# EAGLE design MSEE LCD Breakout Board (EAGLE 9.5.2)
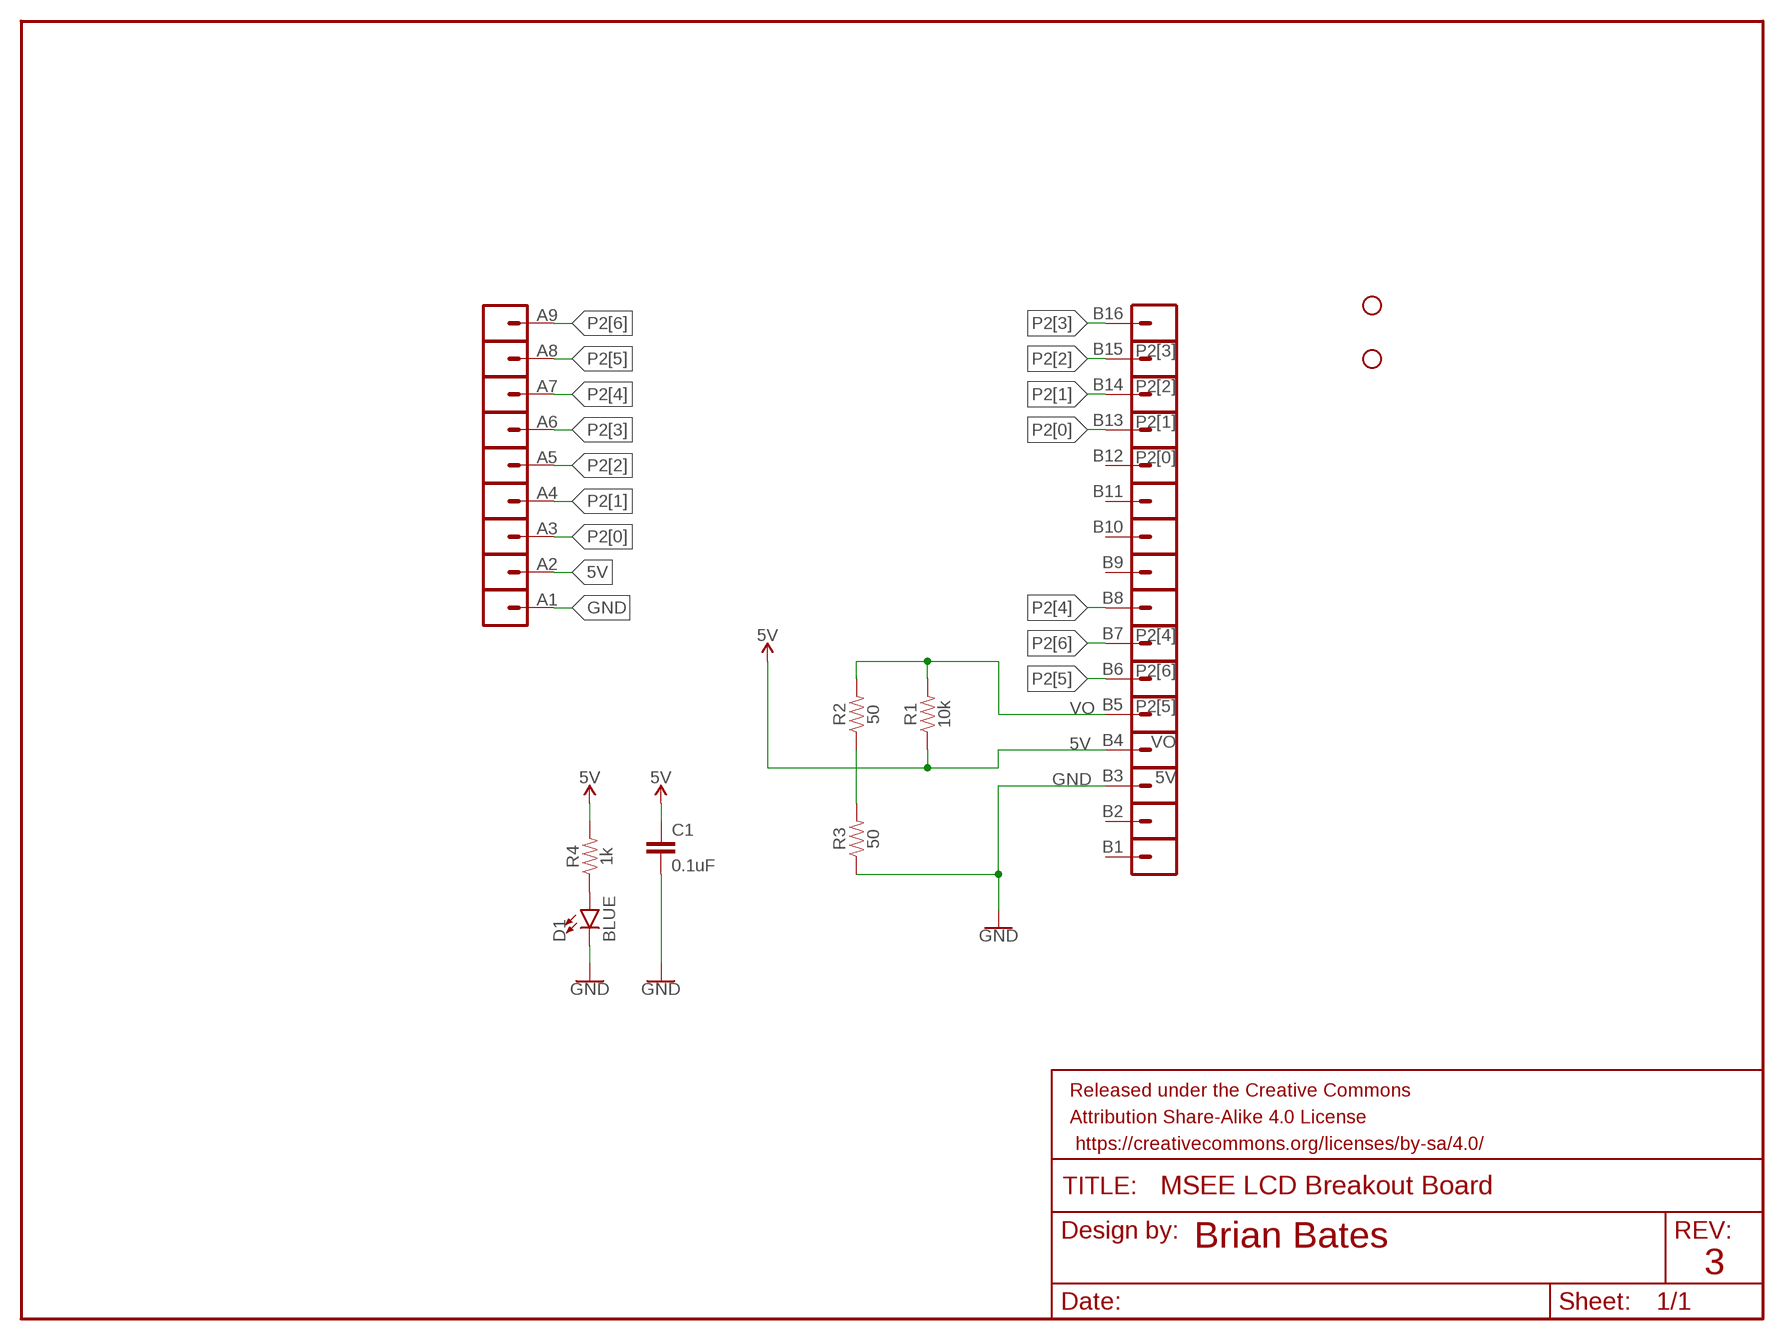
[diagram p0: schematic, sheet 1]

## Parts
5V  A2  CONN_01PTH_LONGPAD  [1X01_LONGPAD]
B1  CONN_01PTH_LONGPAD  [1X01_LONGPAD]
B2  CONN_01PTH_LONGPAD  [1X01_LONGPAD]
B3  GND  CONN_01PTH_LONGPAD  [1X01_LONGPAD]
B4  5V  CONN_01PTH_LONGPAD  [1X01_LONGPAD]
B5  VO  CONN_01PTH_LONGPAD  [1X01_LONGPAD]
B6  P2[5]  CONN_01PTH_LONGPAD  [1X01_LONGPAD]
B7  P2[6]  CONN_01PTH_LONGPAD  [1X01_LONGPAD]
B8  P2[4]  CONN_01PTH_LONGPAD  [1X01_LONGPAD]
B9  CONN_01PTH_LONGPAD  [1X01_LONGPAD]
B10  CONN_01PTH_LONGPAD  [1X01_LONGPAD]
B11  CONN_01PTH_LONGPAD  [1X01_LONGPAD]
B12  CONN_01PTH_LONGPAD  [1X01_LONGPAD]
B13  P2[0]  CONN_01PTH_LONGPAD  [1X01_LONGPAD]
B14  P2[1]  CONN_01PTH_LONGPAD  [1X01_LONGPAD]
B15  P2[2]  CONN_01PTH_LONGPAD  [1X01_LONGPAD]
B16  P2[3]  CONN_01PTH_LONGPAD  [1X01_LONGPAD]
C1  0.1uF  0.1UF-0603-25V-5%  [0603]
D1  BLUE  LED-BLUE0603  [LED-0603]
FRAME1  FRAME-LETTERNO_PACKAGE  [DUMMY]
GND  A1  CONN_01PTH_LONGPAD  [1X01_LONGPAD]
H2  STAND-OFF  [STAND-OFF]
H4  STAND-OFF  [STAND-OFF]
P2[0]  A3  CONN_01PTH_LONGPAD  [1X01_LONGPAD]
P2[1]  A4  CONN_01PTH_LONGPAD  [1X01_LONGPAD]
P2[2]  A5  CONN_01PTH_LONGPAD  [1X01_LONGPAD]
P2[3]  A6  CONN_01PTH_LONGPAD  [1X01_LONGPAD]
P2[4]  A7  CONN_01PTH_LONGPAD  [1X01_LONGPAD]
P2[5]  A8  CONN_01PTH_LONGPAD  [1X01_LONGPAD]
P2[6]  A9  CONN_01PTH_LONGPAD  [1X01_LONGPAD]
R1  10k  10KOHM-0603-1/10W-1%  [0603]
R2  50  47KOHM-0603-1/10W-1%  [0603]
R3  50  47KOHM-0603-1/10W-1%  [0603]
R4  1k  10KOHM-0603-1/10W-1%  [0603]

## Nets
5V: 5V.1 B4.1 C1.1 R1.1 R4.2
'': C1.2 ; supply symbol labelled GND
GND: B3.1 D1.C GND.1 R3.1
N$1: D1.A R4.1
N$2: R2.1 R3.2
P2[0]: B13.1 P2[0].1
P2[1]: B14.1 P2[1].1
P2[2]: B15.1 P2[2].1
P2[3]: B16.1 P2[3].1
P2[4]: B8.1 P2[4].1
P2[5]: B6.1 P2[5].1
P2[6]: B7.1 P2[6].1
VO: B5.1 R1.2 R2.2
Unconnected: B1.1 B2.1 B9.1 B10.1 B11.1 B12.1

## Notes on the sheet
- Brian Bates
- 3

## Library data of the parts
5V B1-B16 GND P2[0] P2[1] P2[2] P2[3] P2[4] P2[5] P2[6] = SparkFun-Connectors:CONN_01: Single connection point. Often used as Generic Header-pin footprint for 0.1 inch spaced/style header connections On any of the 0.1 inch spaced packages, you can populate with these: Break Away Headers - Straight <https://www.sparkfun.com/products/116> (PRT-00116) Break Away Male Headers - Right Angle <https://www.sparkfun.com/products/553> (PRT-00553) Female Headers <https://www.sparkfun.com/products/115> (PRT-00115) Break Away Headers - Machine Pin <https://www.sparkfun.com/products/117> (PRT-00117) Break Away Female Headers - Swiss Machine Pin <https://www.sparkfun.com/products/743> (PRT-00743) This device is also useful as a general connection point to wire up your design to another part of your project. Our various solder wires solder well into these plated through hole pads. Hook-Up Wire - Assortment (Stranded, 22 AWG) <https://www.sparkfun.com/products/11375> (PRT-11375) Hook-Up Wire - Assortment (Solid Core, 22 AWG) <https://www.sparkfun.com/products/11367> (PRT-11367) View the entire wire category on our website here <https://www.sparkfun.com/categories/141> Special notes: SMTSO-256-ET is a "flush mount" nut for a 4-40 screw. We mostly use this on specialty testbeds; it is a nice way to connect hardware to your PCB at an adjustable hieght. Also note, the SNAP packages are for using a snappable style connector. We sell a baggie of snaps and they are also used on two LilyPad designs: Snap Assortment - 30 pack (male and female) <https://www.sparkfun.com/products/11347> (DEV-11347) LilyPad Arduino SimpleSnap <https://www.sparkfun.com/products/10941> (DEV-10941) LilyPad SimpleSnap Protoboard <https://www.sparkfun.com/products/10940> (DEV-10940)
C1 = SparkFun-Capacitors:0.1UF: 0.1µF ceramic capacitors A capacitor is a passive two-terminal electrical component used to store electrical energy temporarily in an electric field.; PROD_ID: CAP-08604
D1 = SparkFun-LED:LED-BLUE: Blue SMD LED Used in manufacturing of various products at SparkFun Packages: 0603 - SMD 0603 package [Product Link] <http://www.digikey.com/product-detail/en/SMLE12BC7TT86/511-1589-2-ND/1641808> 1206 - SMD1206 package [Product Link] <http://www.digikey.com/product-detail/en/lite-on-inc/LTST-C150TBKT/160-1643-1-ND/573584> SparkFun Products: ESP8266 Thing-Dev Board <https://www.sparkfun.com/products/13711> RedBoard <https://www.sparkfun.com/products/12757>; PROD_ID: DIO-08575
FRAME1 = SparkFun-Aesthetics:FRAME-LETTER: Schematic Frame - Letter Standard 8.5x11 US Letter frame; DESIGNER: Nobody; VERSION: v01
H2 H4 = SparkFun-Hardware:STAND-OFF: Stand Off Drill holes for mechanically mounting via screws, standoffs, etc. Note: Use the keepout ring to avoid running the screw head into surrounding components. Variant Overviews STAND-OFF - Mechanical footprint for a #4 phillips button head screw. STAND-OFF-TIGHT - Mechanical footprint for a #4 phillips button head screw, Example SparkFun Products Screw - Phillips Head (1/4", 4-40, 10 pack) <https://www.sparkfun.com/products/10453> (PRT-10453) Screw - Phillips Head (1/2", 4-40, 10 pack) <https://www.sparkfun.com/products/10452> (PRT-10452) Screw - Phillips Head (3/4", 4-40, 10 pack) <https://www.sparkfun.com/products/10451> (PRT-10451) Screw - Phillips Head (1", 4-40, 10 pack) <https://www.sparkfun.com/products/10450> (PRT-10450)
R1 = SparkFun-Resistors:10KOHM: 10kΩ resistor A resistor is a passive two-terminal electrical component that implements electrical resistance as a circuit element. Resistors act to reduce current flow, and, at the same time, act to lower voltage levels within circuits. - Wikipedia; PROD_ID: RES-00824
R2 R3 = SparkFun-Resistors:47KOHM: 47kΩ resistor A resistor is a passive two-terminal electrical component that implements electrical resistance as a circuit element. Resistors act to reduce current flow, and, at the same time, act to lower voltage levels within circuits. - Wikipedia; PROD_ID: RES-07871; VALUE: 47k
R4 = SparkFun-Resistors:10KOHM: 10kΩ resistor A resistor is a passive two-terminal electrical component that implements electrical resistance as a circuit element. Resistors act to reduce current flow, and, at the same time, act to lower voltage levels within circuits. - Wikipedia; PROD_ID: RES-00824; VALUE: 10k

## Net classes
0 default: clearance 0.254 mm

## Board
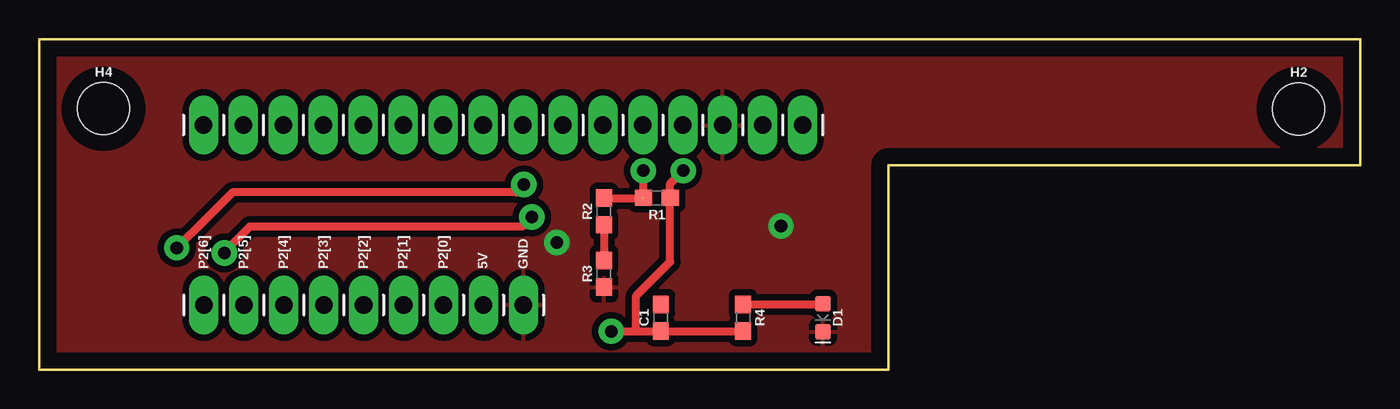
[diagram p1: board, top side]
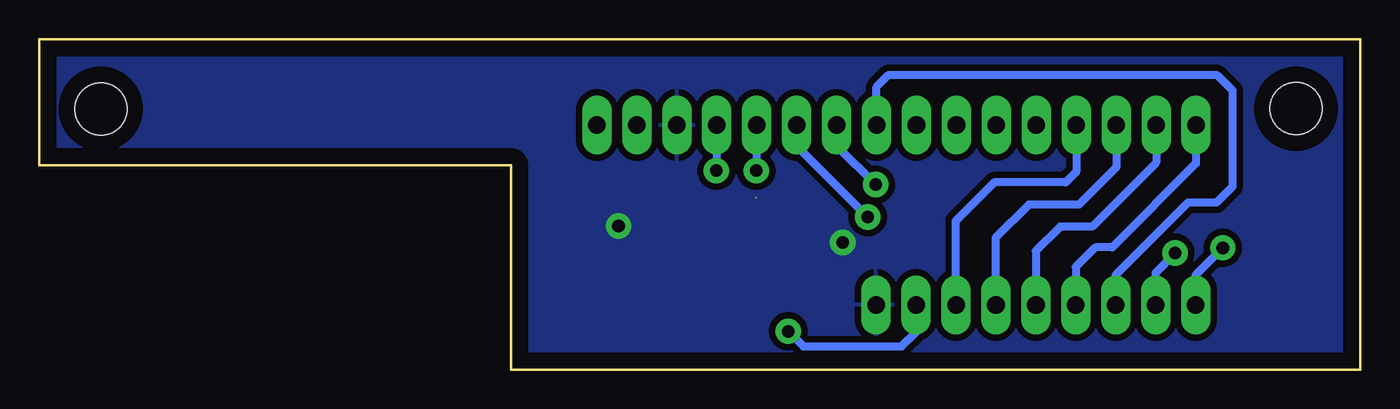
[diagram p2: board, bottom side, seen from below]

Size 84 x 21 mm. Coordinates in mm from the lower left corner, seen from the top.
Outline: 0,0 54,0 54,13 84,13 84,21 0,21 0,0
Copper layers (1*16): Top 0.035mm / dielectric 1.5mm / Bottom 0.035mm
Design rules "default *": minimum track width 20mil, minimum drill 31.25mil, track to track 16mil, track to pad 16mil, pad to pad 16mil, via to via 16mil, smd to smd 16mil, copper to edge 40mil, drill to drill 6mil, minimum pad ring 10mil, minimum via ring 16mil, stop-mask expansion 4mil, vias tented up to drill 0mil, thermal gap 16mil

### Footprints (pad centres in the part's own frame; a part is rotated, then mirrored left to right if it is on the bottom)
1X01_LONGPAD = drill 1.118 pad 1.88 long: 1 0,0
0603 = smd 1.1 x 1: 1 -0.85,0; 2 0.85,0
LED-0603 = smd 1 x 1: A -0.877,0; C 0.877,0
STAND-OFF = hole 3.302: 0,0

### Placement (x,y rotation side)
5V  28.24,4.11 0 top
B1  48.54,15.54 0 top
B2  46,15.54 0 top
B3  43.46,15.54 0 top
B4  40.92,15.54 0 top
B5  38.38,15.54 0 top
B6  35.84,15.54 0 top
B7  33.3,15.54 0 top
B8  30.76,15.54 0 top
B9  28.22,15.54 0 top
B10  25.68,15.54 0 top
B11  23.14,15.54 0 top
B12  20.6,15.54 0 top
B13  18.06,15.54 0 top
B14  15.52,15.54 0 top
B15  12.98,15.54 0 top
B16  10.44,15.54 0 top
C1  39.52,3.3 90 top
D1  49.83,3.3 270 top
FRAME1  -0.3,-0.46 0 top
GND  30.78,4.11 0 top
H2  80.09,16.58 0 top
H4  4.08,16.59 0 top
P2[0]  25.7,4.11 0 top
P2[1]  23.16,4.11 0 top
P2[2]  20.62,4.11 0 top
P2[3]  18.08,4.11 0 top
P2[4]  15.54,4.11 0 top
P2[5]  13,4.11 0 top
P2[6]  10.46,4.11 0 top
R1  39.27,10.92 180 top
R2  35.92,10.06 90 top
R3  35.92,6.1 90 top
R4  44.75,3.3 270 top

### Tracks (layer width: path | path; a pad name or v marks a point on that pad's centre or on a via)
5V  (via drill 0.8)
  Top 0.508: v36.37,2.44 36.38,2.45 37.95,2.45 | 37.95,2.45 37.95,4.69 40.12,6.86 R1.1 40.12,11.82 v40.95,12.65 | 37.95,2.45 C1.1 R4.2
  Bottom 0.508: v36.37,2.44 35.41,1.47 29.16,1.47 28.25,2.39 5V.1 | B4.1 40.92,12.68 v40.95,12.65
GND  (via drill 0.8)
  other vias: 47.17,9.14 32.92,8.08
  pour Top: 0,21.01 84,21.01 84,13 54,13 54,0 0,0
  pour Bottom: 0,21.01 84,21.01 84,13 54,13 54,0 0,0
N$1
  Top 0.508: R4.1 49.81,4.15 D1.A
N$2
  Top 0.508: R2.1 R3.2
P2[0]
  Bottom 0.508: B13.1 18.06,12.57 18.72,11.91 23.27,11.91 25.73,9.45 25.73,4.14 P2[0].1
P2[1]
  Bottom 0.508: B14.1 15.52,12.85 17.88,10.49 21.08,10.49 23.19,8.38 23.19,4.14 P2[1].1
P2[2]
  Bottom 0.508: B15.1 12.98,13.16 17.04,9.09 19.07,9.09 20.62,7.54 P2[2].1
P2[3]
  Bottom 0.508: B16.1 10.44,13.11 15.77,7.77 16.84,7.77 18.09,6.53 P2[3].1
P2[4]
  Bottom 0.508: B8.1 30.76,17.98 30,18.75 9.12,18.75 8.13,17.75 8.13,11.63 9.14,10.62 10.95,10.62 15.54,6.02 P2[4].1
P2[5]  (via drill 0.8)
  Top 0.508: v31.32,9.7 30.71,9.09 13.39,9.09 11.76,7.47 v11.76,7.42
  Bottom 0.508: B6.1 35.84,14.22 v31.32,9.7 | P2[5].1 13.01,6.17 v11.76,7.42
P2[6]  (via drill 0.8)
  Top 0.508: v30.81,11.76 30.33,11.28 12.29,11.28 10.52,9.5 v8.74,7.75
  Bottom 0.508: B7.1 33.3,14.25 v30.81,11.76 | P2[6].1 10.46,6.02 v8.74,7.75
VO  (via drill 0.8)  (2 unrouted)
  Top 0.508: R2.2 38.41,10.91 | v38.41,12.65 38.41,10.94
  Bottom 0.508: B5.1 38.38,12.68 v38.41,12.65